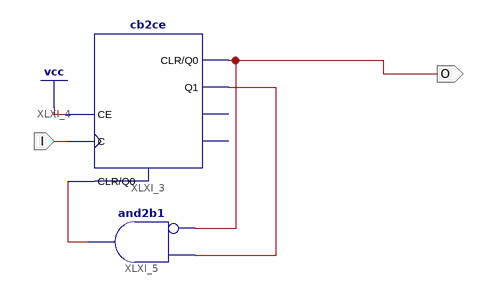
[diagram p0: schematic sheet 1]
// Xilinx ISE schematic counter0_1.sch (spartan6) as structural Verilog: 2 symbols, 2 ports
module counter0_1 (
  input  I,
  output O
);

  wire XLXN_5;

  cb2ce XLXI_3 (.C(I), .CE(1'b1), .CLR(O), .Q0(O), .Q1(XLXN_5));  // open: CEO, TC
  and XLXI_5 (O, ~O, XLXN_5);  // and2b1
endmodule
